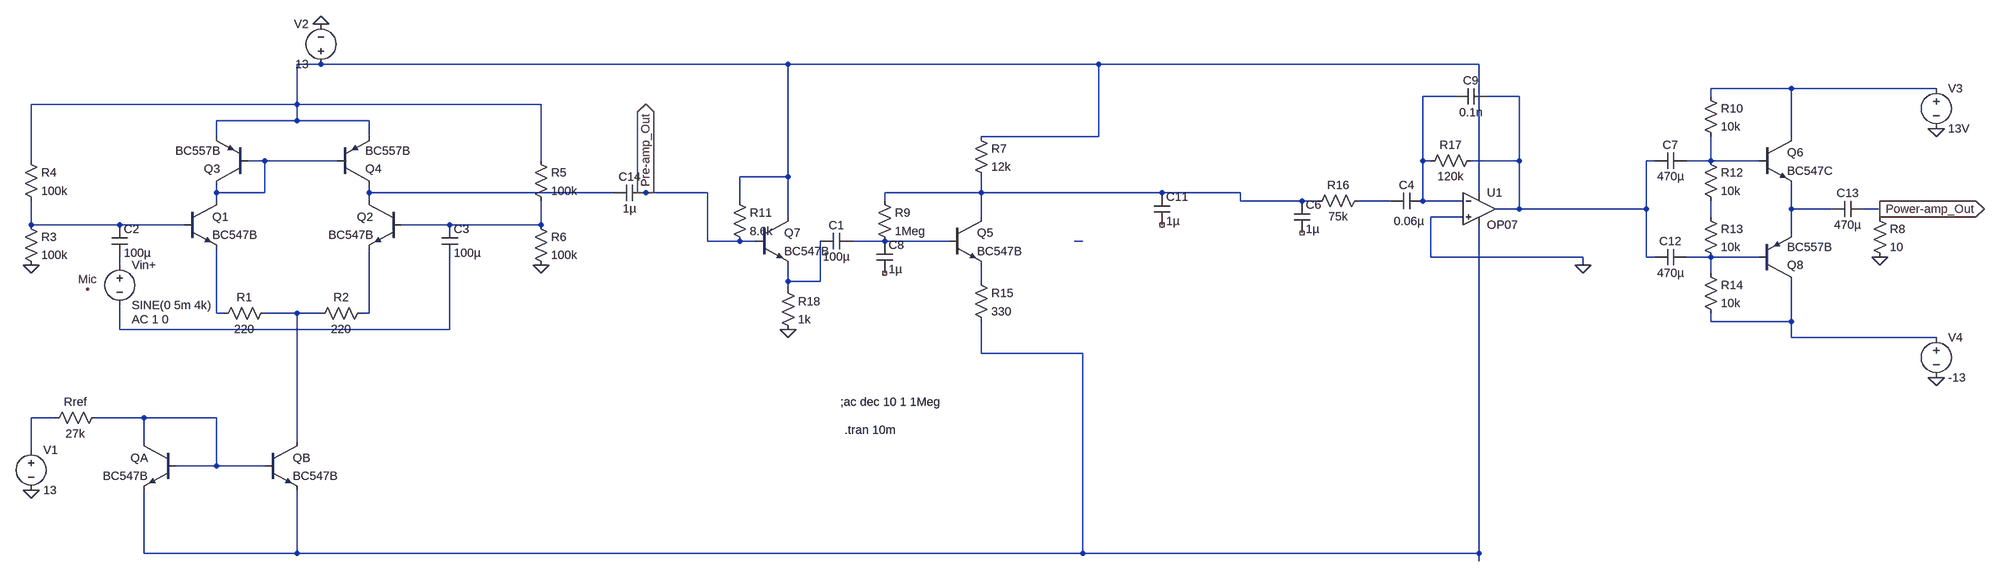
[diagram p0: schematic Complete_ckt.asc]
Complete_ckt.asc, the LTspice schematic file:
Version 4
SHEET 1 4600 1044
WIRE 112 -192 64 -192
WIRE 1312 -192 112 -192
WIRE 1936 -192 1312 -192
WIRE 3472 -192 1936 -192
WIRE 4176 -144 4016 -144
WIRE 4464 -144 4176 -144
WIRE 3424 -128 3360 -128
WIRE 3552 -128 3488 -128
WIRE 4016 -128 4016 -144
WIRE 64 -112 64 -192
WIRE 64 -112 -464 -112
WIRE 656 -112 64 -112
WIRE 64 -80 64 -112
WIRE 64 -80 -96 -80
WIRE 208 -80 64 -80
WIRE -96 -48 -96 -80
WIRE 208 -48 208 -80
WIRE 1936 -48 1936 -192
WIRE 1936 -48 1696 -48
WIRE 4176 -48 4176 -144
WIRE -464 0 -464 -112
WIRE 0 0 -32 0
WIRE 144 0 0 0
WIRE 656 0 656 -112
WIRE 3360 0 3360 -128
WIRE 3376 0 3360 0
WIRE 3552 0 3552 -128
WIRE 3552 0 3456 0
WIRE 3904 0 3888 0
WIRE 4016 0 4016 -48
WIRE 4016 0 3968 0
WIRE 4112 0 4016 0
WIRE 1312 32 1312 -192
WIRE 1312 32 1216 32
WIRE -96 64 -96 48
WIRE 0 64 0 0
WIRE 0 64 -96 64
WIRE 208 64 208 48
WIRE 800 64 208 64
WIRE 864 64 848 64
WIRE 1152 64 864 64
WIRE 1696 64 1696 32
WIRE 1696 64 1504 64
WIRE 2112 64 1696 64
WIRE 2784 64 2112 64
WIRE 3472 64 3472 -192
WIRE -96 80 -96 64
WIRE 208 80 208 64
WIRE 1216 80 1216 32
WIRE 1504 80 1504 64
WIRE 2784 80 2784 64
WIRE 3120 80 2784 80
WIRE 3152 80 3120 80
WIRE 3296 80 3232 80
WIRE 3360 80 3360 0
WIRE 3440 80 3360 80
WIRE 3552 96 3552 0
WIRE 3552 96 3504 96
WIRE 3888 96 3888 0
WIRE 3888 96 3552 96
WIRE 4176 96 4176 48
WIRE 4256 96 4176 96
WIRE 4352 96 4320 96
WIRE 1312 112 1312 32
WIRE 1696 112 1696 64
WIRE 3440 112 3376 112
WIRE 4016 112 4016 80
WIRE 4352 112 4352 96
WIRE -464 128 -464 80
WIRE -288 128 -464 128
WIRE -160 128 -288 128
WIRE 368 128 272 128
WIRE 656 128 656 80
WIRE 656 128 368 128
WIRE 4176 144 4176 96
WIRE 1152 160 1152 64
WIRE 1216 160 1152 160
WIRE 1248 160 1216 160
WIRE 1504 160 1440 160
WIRE 1632 160 1504 160
WIRE 1904 160 1888 160
WIRE 3376 192 3376 112
WIRE 3680 192 3376 192
WIRE 3888 192 3888 96
WIRE 3904 192 3888 192
WIRE 4016 192 3968 192
WIRE 4112 192 4016 192
WIRE -288 208 -288 192
WIRE 3680 208 3680 192
WIRE 4016 224 4016 192
WIRE 1312 240 1312 208
WIRE 1376 240 1376 160
WIRE 1376 240 1312 240
WIRE 1696 240 1696 208
WIRE 1312 256 1312 240
WIRE -96 304 -96 176
WIRE -80 304 -96 304
WIRE 64 304 0 304
WIRE 112 304 64 304
WIRE 208 304 208 176
WIRE 208 304 192 304
WIRE 4016 320 4016 304
WIRE 4176 320 4176 240
WIRE 4176 320 4016 320
WIRE -288 336 -288 288
WIRE 368 336 368 192
WIRE 368 336 -288 336
WIRE 4176 352 4176 320
WIRE 4464 352 4176 352
WIRE 1696 384 1696 320
WIRE 1904 384 1696 384
WIRE -416 512 -464 512
WIRE -240 512 -336 512
WIRE -96 512 -240 512
WIRE -240 560 -240 512
WIRE 64 560 64 304
WIRE -464 576 -464 512
WIRE -96 608 -96 512
WIRE -96 608 -176 608
WIRE 0 608 -96 608
WIRE -240 880 -240 656
WIRE 64 880 64 656
WIRE 64 880 -240 880
WIRE 1904 880 1904 384
WIRE 1904 880 64 880
WIRE 3472 880 3472 128
WIRE 3472 880 1904 880
WIRE 3472 896 3472 880
FLAG -464 656 0
FLAG -464 208 0
FLAG 656 208 0
FLAG 3680 208 0
FLAG 4464 432 0
FLAG 112 -272 0
FLAG 1312 336 0
FLAG 4464 -64 0
FLAG 864 64 Pre-amp_Out
IOPIN 864 64 Out
FLAG -352 256 Mic
FLAG 4352 96 Power-amp_Out
IOPIN 4352 96 Out
FLAG 4352 192 0
DATAFLAG 4016 0 ""
DATAFLAG 4016 192 ""
DATAFLAG 4016 -144 ""
DATAFLAG 4016 320 ""
SYMBOL npn 272 80 M0
SYMATTR InstName Q2
SYMATTR Value BC547B
SYMBOL npn -160 80 R0
SYMATTR InstName Q1
SYMATTR Value BC547B
SYMBOL res 16 288 R90
WINDOW 0 0 56 VBottom 2
WINDOW 3 32 56 VTop 2
SYMATTR InstName R1
SYMATTR Value 220
SYMBOL res 208 288 R90
WINDOW 0 0 56 VBottom 2
WINDOW 3 32 56 VTop 2
SYMATTR InstName R2
SYMATTR Value 220
SYMBOL npn 0 560 R0
SYMATTR InstName QB
SYMATTR Value BC547B
SYMBOL npn -176 560 M0
SYMATTR InstName QA
SYMATTR Value BC547B
SYMBOL res -320 496 R90
WINDOW 0 0 56 VBottom 2
WINDOW 3 32 56 VTop 2
SYMATTR InstName Rref
SYMATTR Value 27k
SYMBOL voltage -288 192 R0
WINDOW 123 24 124 Left 2
WINDOW 39 0 0 Left 0
SYMATTR Value2 AC 1 0
SYMATTR InstName Vin+
SYMATTR Value SINE(0 5m 4k)
SYMBOL voltage -464 560 R0
WINDOW 123 0 0 Left 0
WINDOW 39 0 0 Left 0
SYMATTR InstName V1
SYMATTR Value 13
SYMBOL cap -304 128 R0
SYMATTR InstName C2
SYMATTR Value 100µ
SYMBOL res -480 112 R0
SYMATTR InstName R3
SYMATTR Value 100k
SYMBOL res -480 -16 R0
SYMATTR InstName R4
SYMATTR Value 100k
SYMBOL res 640 -16 R0
SYMATTR InstName R5
SYMATTR Value 100k
SYMBOL res 640 112 R0
SYMATTR InstName R6
SYMATTR Value 100k
SYMBOL npn 1632 112 R0
SYMATTR InstName Q5
SYMATTR Value BC547B
SYMBOL res 1680 -64 R0
SYMATTR InstName R7
SYMATTR Value 12k
SYMBOL cap 1440 144 R90
WINDOW 0 0 32 VBottom 2
WINDOW 3 32 32 VTop 2
SYMATTR InstName C1
SYMATTR Value 100µ
SYMBOL res 1680 224 R0
SYMATTR InstName R15
SYMATTR Value 330
SYMBOL res 1488 64 R0
SYMATTR InstName R9
SYMATTR Value 1Meg
SYMBOL cap 352 128 R0
SYMATTR InstName C3
SYMATTR Value 100µ
SYMBOL cap 3360 64 R90
WINDOW 0 0 32 VBottom 2
WINDOW 3 41 27 VTop 2
SYMATTR InstName C4
SYMATTR Value 0.06µ
SYMBOL res 3248 64 R90
WINDOW 0 0 56 VBottom 2
WINDOW 3 32 56 VTop 2
SYMATTR InstName R16
SYMATTR Value 75k
SYMBOL OpAmps\\OP07 3472 32 R0
SYMATTR InstName U1
SYMBOL res 3472 -16 R90
WINDOW 0 0 56 VBottom 2
WINDOW 3 32 56 VTop 2
SYMATTR InstName R17
SYMATTR Value 120k
SYMBOL voltage 4464 336 R0
WINDOW 123 0 0 Left 0
WINDOW 39 0 0 Left 0
SYMATTR InstName V4
SYMATTR Value -13
SYMBOL voltage 112 -176 R180
WINDOW 0 24 96 Left 2
WINDOW 3 24 16 Left 2
WINDOW 123 0 0 Left 0
WINDOW 39 0 0 Left 0
SYMATTR InstName V2
SYMATTR Value 13
SYMBOL pnp -32 48 R180
SYMATTR InstName Q3
SYMATTR Value BC557B
SYMBOL pnp 144 48 M180
SYMATTR InstName Q4
SYMATTR Value BC557B
SYMBOL npn 1248 112 R0
SYMATTR InstName Q7
SYMATTR Value BC547B
SYMBOL res 1200 64 R0
SYMATTR InstName R11
SYMATTR Value 8.6k
SYMBOL res 1296 240 R0
SYMATTR InstName R18
SYMATTR Value 1k
SYMBOL cap 1488 160 R0
SYMATTR InstName C8
SYMATTR Value 1µ
SYMBOL cap 3488 -144 R90
WINDOW 0 0 32 VBottom 2
WINDOW 3 32 32 VTop 2
SYMATTR InstName C9
SYMATTR Value 0.1n
SYMBOL cap 2096 64 R0
SYMATTR InstName C11
SYMATTR Value 1µ
SYMBOL cap 3104 80 R0
SYMATTR InstName C6
SYMATTR Value 1µ
SYMBOL npn 4112 -48 R0
SYMATTR InstName Q6
SYMATTR Value BC547C
SYMBOL pnp 4112 240 M180
SYMATTR InstName Q8
SYMATTR Value BC557B
SYMBOL cap 3968 -16 R90
WINDOW 0 0 32 VBottom 2
WINDOW 3 32 32 VTop 2
SYMATTR InstName C7
SYMATTR Value 470µ
SYMBOL cap 3968 176 R90
WINDOW 0 0 32 VBottom 2
WINDOW 3 32 32 VTop 2
SYMATTR InstName C12
SYMATTR Value 470µ
SYMBOL res 4000 -144 R0
SYMATTR InstName R10
SYMATTR Value 10k
SYMBOL res 4000 -16 R0
SYMATTR InstName R12
SYMATTR Value 10k
SYMBOL res 4000 96 R0
SYMATTR InstName R13
SYMATTR Value 10k
SYMBOL res 4000 208 R0
SYMATTR InstName R14
SYMATTR Value 10k
SYMBOL voltage 4464 -160 R0
WINDOW 123 0 0 Left 0
WINDOW 39 0 0 Left 0
SYMATTR InstName V3
SYMATTR Value 13V
SYMBOL cap 4320 80 R90
WINDOW 0 0 32 VBottom 2
WINDOW 3 32 32 VTop 2
SYMATTR InstName C13
SYMATTR Value 470µ
SYMBOL cap 864 48 R90
WINDOW 0 0 32 VBottom 2
WINDOW 3 32 32 VTop 2
SYMATTR InstName C14
SYMATTR Value 1µ
SYMBOL res 4336 96 R0
SYMATTR InstName R8
SYMATTR Value 10
TEXT 1424 536 Left 2 !.tran 10m
TEXT 1416 480 Left 2 !;ac dec 10 1 1Meg

The netlist it stands for:
* Complete_ckt.asc
Q2 N007 N013 N022 0 BC547B
Q1 N005 N012 N020 0 BC547B
R1 N021 N020 220
R2 N022 N021 220
QB N021 N027 N025 0 BC547B
QA N027 N027 N025 0 BC547B
Rref N027 N026 27k
Vin+ N017 N024 SINE(0 5m 4k) AC 1 0
V1 N026 0 13
C2 N012 N017 100µ
R3 N012 0 100k
R4 N001 N012 100k
R5 N001 N013 100k
R6 N013 0 100k
Q5 N008 N014 N019 0 BC547B
R7 N001 N008 12k
C1 N014 N018 100µ
R15 N019 N025 330
R9 N008 N014 1Meg
C3 N013 N024 100µ
C4 N003 N009 0.06µ
R16 N009 N008 75k
XU1 0 N003 N001 N025 N004 LT1001  ; OP07, pins In+ In- V+ V- OUT
R17 N004 N003 120k
V4 N023 0 -13
V2 N001 0 13
Q3 N005 N005 N001 0 BC557B
Q4 N007 N005 N001 0 BC557B
Q7 N001 Pre-amp_Out N018 0 BC547B
R11 N001 Pre-amp_Out 8.6k
R18 N018 0 1k
C8 N014 NC_01 1µ
C9 N004 N003 0.1n
C11 N008 NC_02 1µ
C6 N008 NC_03 1µ
Q6 N002 N006 N010 0 BC547C
Q8 N023 N016 N010 0 BC557B
C7 N006 N004 470µ
C12 N016 N004 470µ
R10 N002 N006 10k
R12 N006 N011 10k
R13 N011 N016 10k
R14 N016 N023 10k
V3 N002 0 13V
C13 Power-amp_Out N010 470µ
C14 Pre-amp_Out N007 1µ
R8 Power-amp_Out 0 10
.model NPN NPN
.model PNP PNP
.lib standard.bjt
.tran 10m
;ac dec 10 1 1Meg
.lib LTC.lib
.backanno
.end